# Altium project FPGA1.PrjPcb (part 2 of 2)

## Sheet POWER0.SchDoc
size 400 x 241 mm; SheetNumber: 7; SheetTotal: 7
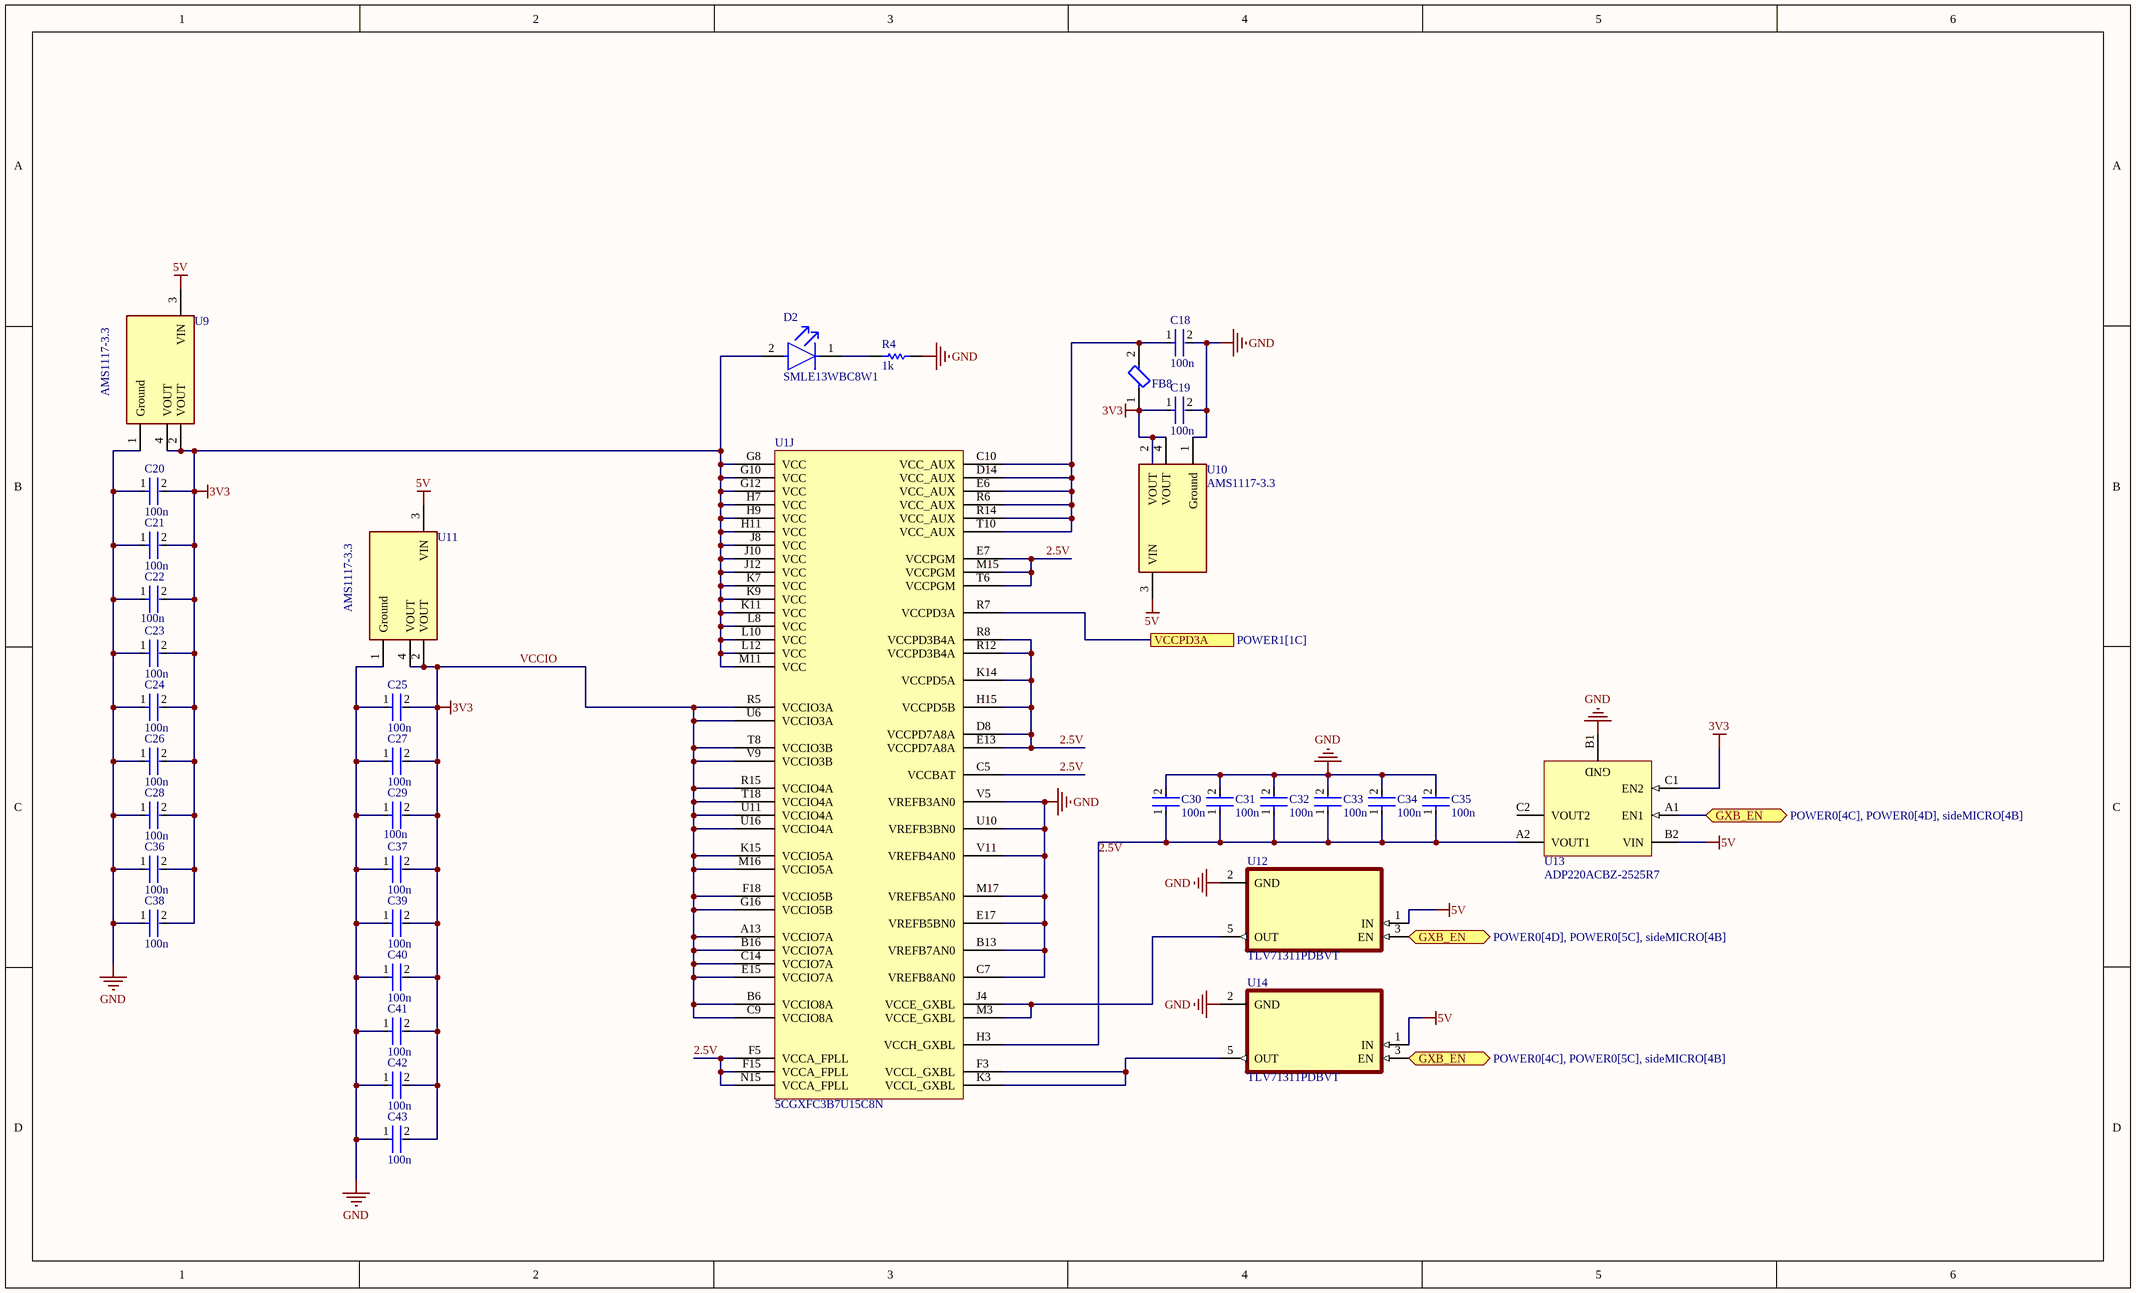
[diagram p6: POWER0.SchDoc]

### Parts
C18  100n  [FP-CL10-IPC_C]
C19  100n  [FP-CL10-IPC_C]
C20  100n  [FP-CL10-IPC_C]
C21  100n  [FP-CL10-IPC_C]
C22  100n  [FP-CL10-IPC_C]
C23  100n  [FP-CL10-IPC_C]
C24  100n  [FP-CL10-IPC_C]
C25  100n  [FP-CL10-IPC_C]
C26  100n  [FP-CL10-IPC_C]
C27  100n  [FP-CL10-IPC_C]
C28  100n  [FP-CL10-IPC_C]
C29  100n  [FP-CL10-IPC_C]
C30  100n  [FP-CL10-IPC_C]
C31  100n  [FP-CL10-IPC_C]
C32  100n  [FP-CL10-IPC_C]
C33  100n  [FP-CL10-IPC_C]
C34  100n  [FP-CL10-IPC_C]
C35  100n  [FP-CL10-IPC_C]
C36  100n  [FP-CL10-IPC_C]
C37  100n  [FP-CL10-IPC_C]
C38  100n  [FP-CL10-IPC_C]
C39  100n  [FP-CL10-IPC_C]
C40  100n  [FP-CL10-IPC_C]
C41  100n  [FP-CL10-IPC_C]
C42  100n  [FP-CL10-IPC_C]
C43  100n  [FP-CL10-IPC_C]
D2  SMLE13WBC8W1  [FP-SMLE13WBC8W1-MFG]
FB8  BLM18KG121TN1D  [FP-BLM18-0_15-t0_6-d1_2-IPC_A]  (value not drawn)
R4  1k  [RESC2013X60X35ML10T20]
U1  5CGXFC3B7U15C8N  [ALTR-UBGA324_A-150]  (part J of 12)
U9  AMS1117-3.3  [FP-AMS1117-IPC_C]
U10  AMS1117-3.3  [FP-AMS1117-IPC_C]
U11  AMS1117-3.3  [FP-AMS1117-IPC_C]
U12  TLV71311PDBVT  [SOT95P280X145-5N_TLV71311PDBVT]
U13  ADP220ACBZ-2525R7  [ADI-CB-6-2]
U14  TLV71311PDBVT  [SOT95P280X145-5N_TLV71311PDBVT]

### Ports
GXB_EN (bidir, see POWER0[4C], POWER0[4D], sideMICRO[4B]), GXB_EN (bidir, see POWER0[4C], POWER0[5C], sideMICRO[4B]), GXB_EN (bidir, see POWER0[4D], POWER0[5C], sideMICRO[4B]), VCCPD3A (see POWER1[1C])

### Nets
5V: U9.3(VIN) U10.3(VIN) U11.3(VIN) U12.1(IN) U13.B2(VIN) U14.1(IN)
GND: C18.2 C19.2 C20.1 C21.1 C22.1 C23.1 C24.1 C25.1 C26.1 C27.1 C28.1 C29.1 C30.2 C31.2 C32.2 C33.2 C34.2 C35.2 C36.1 C37.1 C38.1 C39.1 C40.1 C41.1 C42.1 C43.1 R4.2 U1.B13(VREFB7AN0) U1.C7(VREFB8AN0) U1.E17(VREFB5BN0) U1.M17(VREFB5AN0) U1.U10(VREFB3BN0) U1.V5(VREFB3AN0) U1.V11(VREFB4AN0) U9.1(Ground) U10.1(Ground) U11.1(Ground) U12.2(GND) U13.B1(GND) U14.2(GND)
VCCIO: C19.1 C20.2 C21.2 C22.2 C23.2 C24.2 C25.2 C26.2 C27.2 C28.2 C29.2 C36.2 C37.2 C38.2 C39.2 C40.2 C41.2 C42.2 C43.2 D2.2(A) FB8.1 U1.A13(VCCIO7A) U1.B6(VCCIO8A) U1.B16(VCCIO7A) U1.C9(VCCIO8A) U1.C14(VCCIO7A) U1.E15(VCCIO7A) U1.F18(VCCIO5B) U1.G8(VCC) U1.G10(VCC) U1.G12(VCC) U1.G16(VCCIO5B) U1.H7(VCC) U1.H9(VCC) U1.H11(VCC) U1.J8(VCC) U1.J10(VCC) U1.J12(VCC) U1.K7(VCC) U1.K9(VCC) U1.K11(VCC) U1.K15(VCCIO5A) U1.L8(VCC) U1.L10(VCC) U1.L12(VCC) U1.M11(VCC) U1.M16(VCCIO5A) U1.R5(VCCIO3A) U1.R15(VCCIO4A) U1.T8(VCCIO3B) U1.T18(VCCIO4A) U1.U6(VCCIO3A) U1.U11(VCCIO4A) U1.U16(VCCIO4A) U1.V9(VCCIO3B) U9.2(VOUT) U9.4(VOUT) U10.2(VOUT) U10.4(VOUT) U11.2(VOUT) U11.4(VOUT) U13.C1(EN2)  [also labelled 3V3]
2.5V: C30.1 C31.1 C32.1 C33.1 C34.1 C35.1 U1.C5(VCCBAT) U1.D8(VCCPD7A8A) U1.E7(VCCPGM) U1.E13(VCCPD7A8A) U1.F5(VCCA_FPLL) U1.F15(VCCA_FPLL) U1.H3(VCCH_GXBL) U1.H15(VCCPD5B) U1.K14(VCCPD5A) U1.M15(VCCPGM) U1.N15(VCCA_FPLL) U1.R8(VCCPD3B4A) U1.R12(VCCPD3B4A) U1.T6(VCCPGM) U13.A2(VOUT1)
NetC18_1: C18.1 FB8.2 U1.C10(VCC_AUX) U1.D14(VCC_AUX) U1.E6(VCC_AUX) U1.R6(VCC_AUX) U1.R14(VCC_AUX) U1.T10(VCC_AUX)
NetD2_1: D2.1(C) R4.1
NetR3_1: U1.R7(VCCPD3A) ; port VCCPD3A
NetU1_F3: U1.F3(VCCL_GXBL) U1.K3(VCCL_GXBL) U14.5(OUT)
NetU1_J4: U1.J4(VCCE_GXBL) U1.M3(VCCE_GXBL) U12.5(OUT)
NetU6_16: U12.3(EN) U13.A1(EN1) U14.3(EN) ; port GXB_EN

Not connected (* = marked no-connect by the designer): U13 C2(VOUT2)

### Library data of the parts
C18-C43 = CMP-13271-003017-1: Cap Ceramic 4.7uF 10V X5R ±10% Pad SMD 0603 +85°C T/R; Capacitance: 4.7uF; Case/Package: 0603; Packaging: Tape and Reel; Width: 0.031inch; Contact Plating: Tin; Thickness: 0.035inch; Package Quantity: 1; Voltage Rating: 10V; Case Code (Metric): 1608; Case Code (Imperial): 0603; Depth: 0.8mm; Height: 0.8mm; Tolerance: 10%; Max Operating Temperature: 85°C; Length: 1.6mm; Dielectric: X5R; Mount: Surface Mount; Radiation Hardening: No; Min Operating Temperature: -55°C
D2 = CMP-08952-000004-1: LED WHITE 0603 SMD; Manufacturer: Rohm; Luminous Intensity: 140mcd; Led Orientation: Top View; Reverse Voltage: 5V; Forward Voltage: 2.9V; Forward Current: 5mA; Power Dissipation: 66mW; Temperature Range Low: -40°C; Digikey Description: LED WHITE 0603 SMD; Temperature Range High: +85°C; Temperature: -40°C to +85°C; Manufacturer Part Number: SMLE13WBC8W1; Colour: White; Mouser Description: Standard LEDs - SMD ExceLED White LED 120mcd 5mA; Octopart: https://octopart.com/smle13wbc8w1-rohm-22224565; Automotive: No; Device Class L2: LEDs; Lead Free: Yes; ComponentLink2URL: https://media.digikey.com/pdf/Data%20Sheets/Rohm%20PDFs/SMLE13WBC8W1_Spec.pdf; Device Class L3: unset; Package: 0; RoHS: TRUE; Height: 0.4mm; Category: Diode; Device Class L1: Optoelectronics; ComponentLink2Description: Datasheet
FB8 = CMP-0686-00554-8: FERRITE BEAD 120 OHM 0603 1LN; Max Current Rating: 3A; DC Resistance (DCR): 30mR; Impedance: 120R; Number of Lines: 1; Test Frequency: 100MHz; Tolerance: 25%; Package Quantity: 4000; Min Operating Temperature: -55°C; Termination: SMD/SMT; REACH SVHC: No SVHC; Core Material: Ferrite; Material: Ferrite; Current Rating: 3A; Height: 0.8mm; Number of Pins: 2; Case/Package: 0603; Case Code (Imperial): 0603; Series: BLM18K; Packaging: Tape and Reel; Inductor Type: FERRITE BEAD; Lead Free: Lead Free; Width: 0.8mm; Case Code (Metric): 1608; Number of Circuits: 1; Max DC Current: 3A; Depth: 0.95mm; Max Operating Temperature: 125°C; Length: 1.6mm; RoHS Compliant: Yes
R4 = CMP-2100-03673-1: Chip Resistor, 0 Ohm, Jumper, +/- 5%, 0.125 W, -55 to 155 degC, 0805 (2012 Metric), RoHS, Tape and Reel; Manufacturer: Yageo; Power Rating: 125mW; Resistance: 0mOhm; Voltage Rating (DC): 150V; Temperature Coefficient: 200ppm/degreesC; Height: 0.5mm; Depth: 1.25mm; Case Code (Imperial): 0805; Lead Free: LeadFree; Military Standard: Not; Package Description: 2-Pin Surface Mounted Device, Body 2 x 1.25 mm; Case Code (Metric): 2012; Composition: ThickFilm; Voltage Rating: 150V; Manufacturer URL: http://www.yageo.com/; Packaging: TapeandReel; Package Reference: 0805; REACH SVHC: Unknown; Tolerance: 5%; Case/Package: 0805; Max Operating Temperature: 155degC; Number of Pins: 2; Min Operating Temperature: -55degC; RoHSCompliant: true; Length: 2mm; Datasheet URL: http://www.yageo.com/NewPortal/yageodocoutput?fileName=/pdf/R-Chip/PYu-RC_Group_51_RoHS_L_5.pdf; Termination: SMD/SMT; Radiation Hardening: No; Width: 1.25mm; Contact Plating: Tin; Datasheet Version: Rev. 5, 10/2016
U1 = CMP-0469-00059-2: Cyclone V GX Family FPGA, 1.07 to 1.13 V Supply, 144 I/O Pins, 4 PLLs, 324-Pin UBGA, Speed Grade 8, Commercial Grade, RoHS Compliant; Manufacturer: Altera; Logic Elements (LE) (K): 31.5; GPIO: 144; Speed Grade: 8; ComponentLink1Description: Manufacturer URL; ComponentLink5URL: http://www.altera.com/literature/dp/cyclone-v/5CGXFC3.xls; ComponentLink7URL: http://www.buyaltera.com/scripts/partsearch.dll?Detail&name=544-2758-ND; Subcategory: Cyclone V GX; ComponentLink2Description: Datasheet; Voltage Supply: 1.07 to 1.13 V; PackageVersion: Rev. 1.0, 10/2011; ComponentLink7Description: Product URL; ComponentLink4Description: Device Handbook URL; Mounting Technology: Surface Mount; ComponentLink3URL: http://www.altera.com/devicepackaging/04R00433-00.pdf; Code_JEDEC: MO-216-BAK-1; ComponentLink1URL: http://www.altera.com; ComponentLink3Description: Package Specification; Device Group: 5CGXFC3; ComponentLink6URL: http://www.altera.com/literature/hb/cyclone-v/cv_51001.pdf; ComponentLink4URL: http://www.altera.com/literature/hb/cyclone-v/cyclone5_handbook.pdf; PackageDescription: 324-Pin Ultra FineLine Ball-Grid Array (UBGA), Body 15 x 15 mm, Pitch 0.8 mm; RoHS: RoHS Compliant; PackageReference: UBGA324_A-150; DatasheetVersion: Rev. 3.4; PartNumber: 5CGXFC3B7U15C8N; ComponentLink2URL: http://www.altera.com/literature/hb/cyclone-v/cv_51002.pdf; ComponentLink6Description: Device Overview URL; ComponentLink5Description: Device Pin-Out URL; NexusDeviceID: 5CGXFC3B7U15C8N
U9-U11 = CMP-209535-000001-1: LDO Voltage Regulators 1A, 3.3V; Manufacturer: Advanced Monolithic Systems; Dropout Voltage: 1.1V; Output Type: Fixed; Nominal Supply Current: 5mA; Max Power Dissipation: 1.2W; Max Supply Voltage: 15V; Number Of Outputs: 1; Standoff Height: 0.64mm; Max Junction Temp: +125°C; Height: 1.8mm; Package: AMS1117; Device Class L2: Power Management ICs; ComponentLink2Description: Datasheet; ComponentLink2URL: http://www.advanced-monolithic.com/pdf/ds1117.pdf; Category: IC; RoHS: TRUE; Automotive: No; Device Class L1: Integrated Circuits (ICs); Output Current: 1A; Device Class L3: Voltage Regulators - Linear; Temperature: -40°C to +125°C; Output Voltage: 3.3V; Manufacturer Part Number: AMS1117-3.3; Temperature Range Low: -40°C; Octopart: https://octopart.com/ams1117-3.3-advanced+monolithic+systems-25899300; Lead Free: Yes; Ipc Land Pattern Name: SOT229P700X180-4; Temperature Range High: +125°C
U13 = CMP-0786-00026-1: Dual, 200 mA, Low Noise, High PSRR Voltage Regulator, 2.5 to 5.5 V Vin, 2.5 V Vout, Industrial, 6-pin BGA (CB-6-2), Reel; Manufacturer: Analog Devices; Supply Current IGND @ Small Load: 60uA; Vin (max) (V): 5.5; Vin (min) (V): 2.5; Iout max: 200mA; Preset Vout Values (V): 2.5; 2.5; ComponentLink3Description: Package Specification; DatasheetVersion: 08-15-2012-A; ComponentLink2Description: Datasheet; PackageDescription: 6-Ball Wafer Level Chip Scale Package, Body 1.45 x 0.95 mm, Pitch 0.5 mm; ComponentLink4URL: Product URL:http://www.analog.com/en/ADP220/productSearch.html; ComponentLink1URL: http://www.analog.com/en/index.html; Mounting Technology: Surface Mount; ComponentLink3URL: http://www.analog.com/static/imported-files/data_sheets/AD8312.pdf; PackageReference: CB-6-2; ComponentLink2URL: http://www.analog.com/static/imported-files/data_sheets/ADP220_221.pdf; Packing: Reel; PackageVersion: 062206-A, 06/2006; PartNumber: ADP220ACBZ-2525R7; ComponentLink4Description: URL Link1; ComponentLink1Description: Manufacturer URL
U12 U14 = TLV71311PDBVT: Package: None; Price: None; Value: *; MP: TLV71311PDBVT; Availability: Unavailable

## Nets that join several sheets
5V: IO1 (U2.3), POWER1 (U4.3), IO2 (U5.3), CONNECTORS (U7.3 U8.3), POWER0 (6 pins)
GND: IO1 (12 pins), POWER1 (86 pins), IO2 (31 pins), CONNECTORS2 (21 pins), sideMICRO (13 pins), CONNECTORS (33 pins), POWER0 (40 pins)
VCCIO: IO1 (C1.1 FB1.1 U2.2 U2.4), POWER1 (C3.1 FB2.1 U4.2 U4.4), IO2 (C5.1 FB3.1 U5.2 U5.4), sideMICRO (C11.1 C12.1 FB4.1 FB5.1), CONNECTORS (C15.1 FB6.1 U7.2 U7.4), POWER0 (62 pins)
CLK0: IO1 (U1.P13 U1.T12 Y1.4), CONNECTORS (J6.A5 J6.B5)
NetJ1_1: IO1 (U1.P4), CONNECTORS2 (J1.1)
NetJ1_2: IO1 (U1.R4), CONNECTORS2 (J1.2)
NetJ1_3: IO1 (U1.M8), CONNECTORS2 (J1.3)
NetJ1_4: IO1 (U1.M9), CONNECTORS2 (J1.4)
NetJ1_5: IO1 (U1.U7), CONNECTORS2 (J1.5)
NetJ1_6: IO1 (U1.T7), CONNECTORS2 (J1.6)
NetJ1_7: IO1 (U1.M10), CONNECTORS2 (J1.7)
NetJ1_8: IO1 (U1.N10), CONNECTORS2 (J1.8)
NetJ1_9: IO1 (U1.V2), CONNECTORS2 (J1.9)
NetJ1_10: IO1 (U1.V3), CONNECTORS2 (J1.10)
NetJ1_11: IO1 (U1.M7), CONNECTORS2 (J1.11)
NetJ1_12: IO1 (U1.N7), CONNECTORS2 (J1.12)
NetJ2_3: IO1 (U1.U14), CONNECTORS2 (J2.3)
NetJ2_4: IO1 (U1.U15), CONNECTORS2 (J2.4)
NetJ2_5: IO1 (U1.T15), CONNECTORS2 (J2.5)
NetJ2_6: IO1 (U1.V15), CONNECTORS2 (J2.6)
NetJ2_7: IO1 (U1.V16), CONNECTORS2 (J2.7)
NetJ2_8: IO1 (U1.V17), CONNECTORS2 (J2.8)
NetJ2_9: IO1 (U1.R18), CONNECTORS2 (J2.9)
NetJ2_10: IO1 (U1.P18), CONNECTORS2 (J2.10)
NetJ3_3: CONNECTORS2 (J3.3), sideMICRO (U6.30)
NetJ3_4: CONNECTORS2 (J3.4), sideMICRO (U6.31)
NetJ3_5: CONNECTORS2 (J3.5), sideMICRO (U6.32)
NetJ3_6: CONNECTORS2 (J3.6), sideMICRO (U6.33)
NetJ3_7: CONNECTORS2 (J3.7), sideMICRO (U6.34)
NetJ3_8: CONNECTORS2 (J3.8), sideMICRO (U6.35)
NetJ3_9: CONNECTORS2 (J3.9), sideMICRO (U6.36)
NetJ3_10: CONNECTORS2 (J3.10), sideMICRO (U6.37)
NetJ4_3: IO2 (U1.A4), CONNECTORS2 (J4.3)
NetJ4_4: IO2 (U1.A7), CONNECTORS2 (J4.4)
NetJ4_5: IO2 (U1.B7), CONNECTORS2 (J4.5)
NetJ4_6: IO2 (U1.E8), CONNECTORS2 (J4.6)
NetJ4_7: IO2 (U1.C1), CONNECTORS2 (J4.7)
NetJ4_8: IO2 (U1.B4), CONNECTORS2 (J4.8)
NetJ4_9: IO2 (U1.B3), CONNECTORS2 (J4.9)
NetJ5_A5: IO1 (U1.R1), CONNECTORS (J5.A5)
NetJ5_A6: IO1 (U1.N2), CONNECTORS (J5.A6)
NetJ5_A7: IO1 (U1.N1), CONNECTORS (J5.A7)
NetJ5_B5: IO1 (U1.L1), CONNECTORS (J5.B5)
NetJ5_B6: IO1 (U1.J2), CONNECTORS (J5.B6)
NetJ5_B7: IO1 (U1.J1), CONNECTORS (J5.B7)
NetJ6_A6: IO1 (U1.V12), CONNECTORS (J6.A6)
NetJ6_A7: IO1 (U1.V13), CONNECTORS (J6.A7)
NetJ6_B6: IO1 (U1.T17), CONNECTORS (J6.B6)
NetJ6_B7: IO1 (U1.U18), CONNECTORS (J6.B7)
NetJ7_1: IO1 (U1.L16), CONNECTORS (J7.1)
NetJ7_3: IO1 (U1.L15), CONNECTORS (J7.3)
NetJ7_4: IO1 (U1.M18), CONNECTORS (J7.4)
NetJ7_6: IO1 (U1.N18), CONNECTORS (J7.6)
NetJ7_7: IO1 (U1.K17), CONNECTORS (J7.7)
NetJ7_9: IO1 (U1.K16), CONNECTORS (J7.9)
NetJ7_10: IO1 (U1.L17), CONNECTORS (J7.10)
NetJ7_12: IO1 (U1.K18), CONNECTORS (J7.12)
NetJ8_1: IO2 (U1.D13), CONNECTORS (J8.1)
NetJ8_2: IO2 (U1.C11), CONNECTORS (J8.2)
NetJ8_5: IO2 (U1.A16), CONNECTORS (J8.5)
NetJ8_7: IO2 (U1.D16), CONNECTORS (J8.7)
NetJ8_8: IO2 (U1.B14), CONNECTORS (J8.8)
NetJ8_10: sideMICRO (U6.42), CONNECTORS (J8.10)
NetR3_1: POWER1 (R3.1), POWER0 (U1.R7)
NetU1_C6: POWER1 (U1.C6), sideMICRO (U6.11)
NetU1_D4: POWER1 (U1.D4), sideMICRO (U6.23)
NetU1_D6: POWER1 (U1.D6), sideMICRO (U6.12)
NetU1_F14: IO2 (U1.F14), sideMICRO (U6.3)
NetU1_H17: IO2 (U1.H17), sideMICRO (U6.2)
NetU1_J18: IO2 (U1.J18), sideMICRO (U6.1)
NetU6_16: sideMICRO (U6.16), POWER0 (U12.3 U13.A1 U14.3)